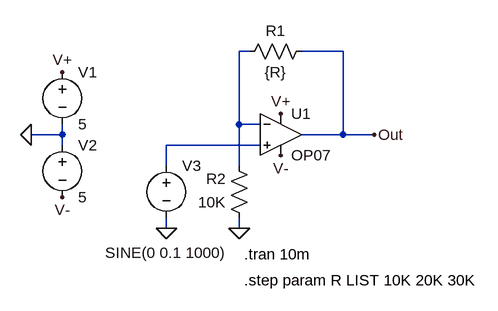
[diagram p0: schematic Op Amp Parameter Sweep.asc]
Op Amp Parameter Sweep.asc, the LTspice schematic file:
Version 4
SHEET 1 880 680
WIRE 64 16 48 16
WIRE 208 16 144 16
WIRE 48 128 48 16
WIRE 80 128 48 128
WIRE -224 144 -224 128
WIRE -224 144 -272 144
WIRE 208 144 208 16
WIRE 208 144 144 144
WIRE 256 144 208 144
WIRE -224 160 -224 144
WIRE 80 160 -64 160
WIRE -64 192 -64 160
WIRE 48 192 48 128
WIRE -64 288 -64 272
WIRE 48 288 48 272
FLAG -224 240 V-
FLAG -224 48 V+
FLAG -272 144 0
FLAG 48 288 0
FLAG -64 288 0
FLAG 112 112 V+
FLAG 112 176 V-
FLAG 256 144 Out
SYMBOL voltage -224 32 R0
WINDOW 123 0 0 Left 2
WINDOW 39 0 0 Left 2
SYMATTR InstName V1
SYMATTR Value 5
SYMBOL voltage -224 144 R0
WINDOW 123 0 0 Left 2
WINDOW 39 0 0 Left 2
SYMATTR InstName V2
SYMATTR Value 5
SYMBOL Opamps\\OP07 112 80 R0
SYMATTR InstName U1
SYMBOL res 48 32 R270
WINDOW 0 32 56 VTop 2
WINDOW 3 0 56 VBottom 2
SYMATTR InstName R1
SYMATTR Value {R}
SYMBOL res 64 288 R180
WINDOW 0 36 76 Left 2
WINDOW 3 36 40 Left 2
SYMATTR InstName R2
SYMATTR Value 10K
SYMBOL voltage -64 176 R0
WINDOW 3 -94 150 Left 2
WINDOW 123 0 0 Left 2
WINDOW 39 0 0 Left 2
SYMATTR InstName V3
SYMATTR Value SINE(0 0.1 1000)
TEXT 56 328 Left 2 !.tran 10m
TEXT 56 368 Left 2 !.step param R LIST 10K 20K 30K

The netlist it stands for:
* Op Amp Parameter Sweep.asc
V1 V+ 0 5
V2 0 V- 5
XU1 N002 N001 V+ V- Out LT1001  ; OP07, pins In+ In- V+ V- OUT
R1 N001 Out {R}
R2 0 N001 10K
V3 N002 0 SINE(0 0.1 1000)
.tran 10m
.step param R LIST 10K 20K 30K
.lib LTC.lib
.backanno
.end